# EAGLE schematic multiplieur (EAGLE 6.3)
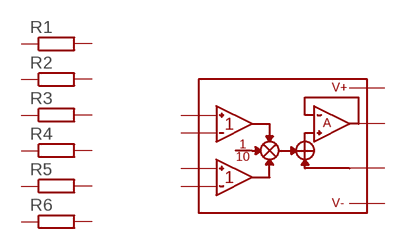
[diagram p0: schematic, sheet 1]

## Parts
R1  R-EU_0204/7  [0204/7]
R2  R-EU_0204/7  [0204/7]
R3  R-EU_0204/7  [0204/7]
R4  R-EU_0204/7  [0204/7]
R5  R-EU_0204/7  [0204/7]
R6  R-EU_0204/7  [0204/7]
U$1  AD633JN  [DIL08]
Unconnected: R1.1 R1.2 R2.1 R2.2 R3.1 R3.2 R4.1 R4.2 R5.1 R5.2 R6.1 R6.2 U$1.1(X1) U$1.2(X2) U$1.3(Y1) U$1.4(Y2) U$1.5(-V) U$1.6(Z) U$1.7(W) U$1.8(+V)

## Library data of the parts
R1-R6 = resistor:R-EU_: RESISTOR, European symbol
U$1 = analog-devices:AD633JN